# EAGLE design msp430_funky (EAGLE 7.5.0)
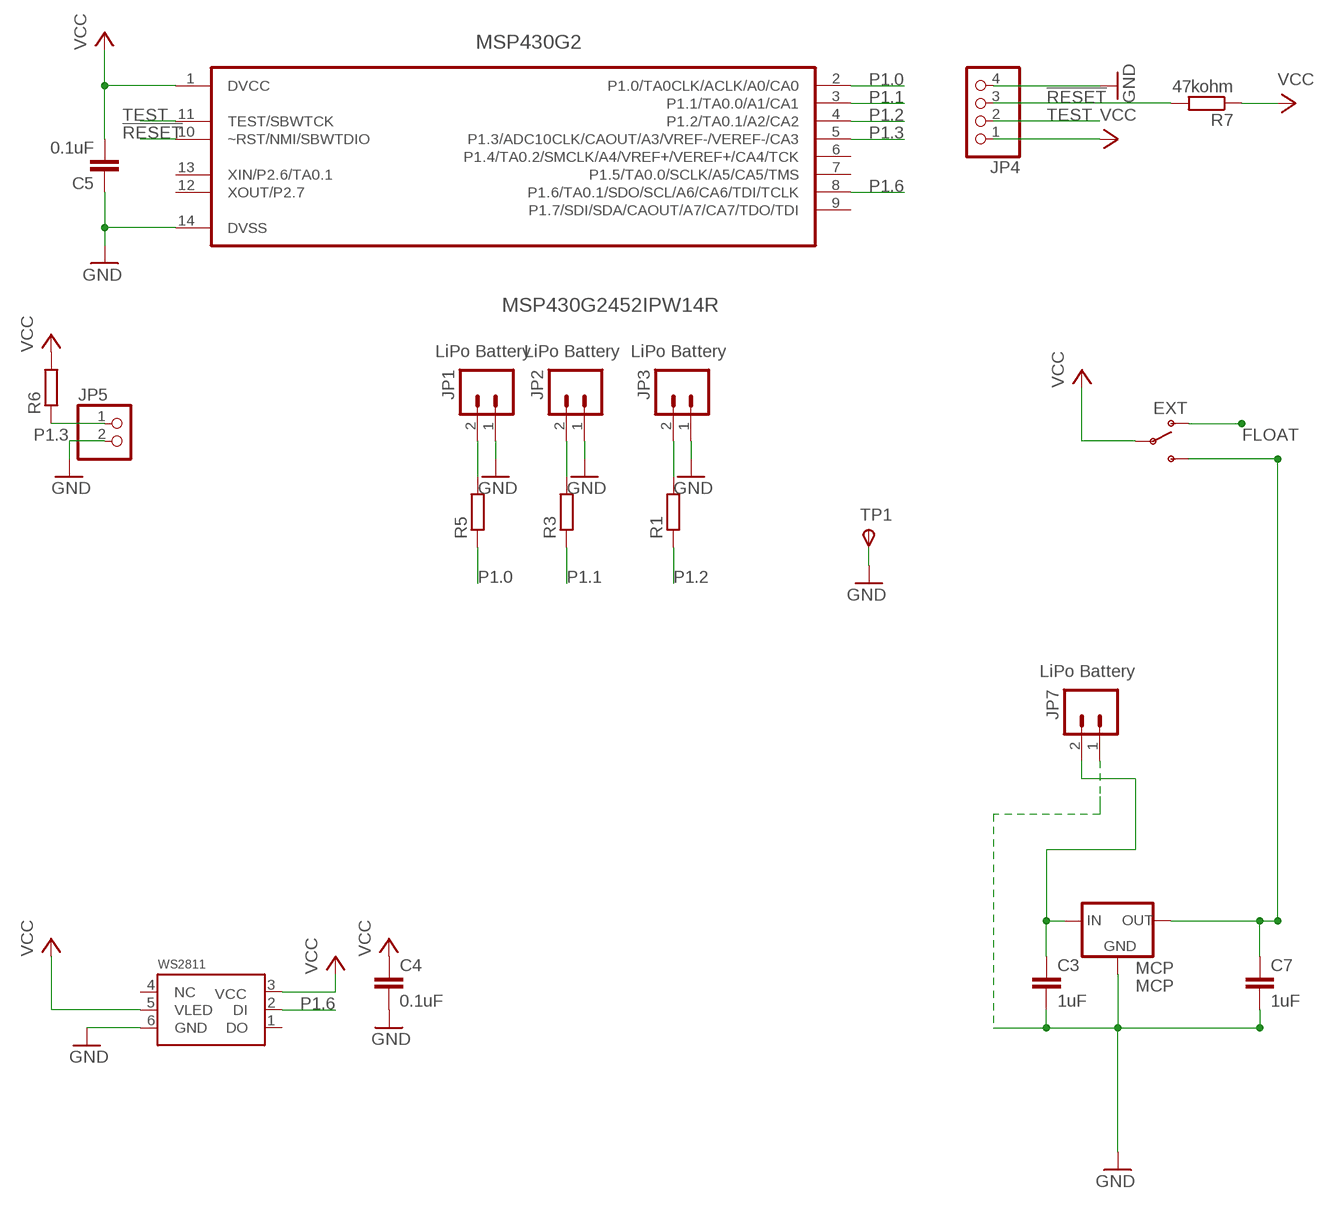
[diagram p0: schematic, sheet 1]

## Parts
C3  1uF  C-EUC0805  [C0805]
C4  0.1uF  C-EUC0805  [C0805]
C5  0.1uF  C-EUC0805  [C0805]
C7  1uF  C-EUC0805  [C0805]
JP1  LiPo Battery  M02JST-PTH-2  [JST-2-PTH]
JP2  LiPo Battery  M02JST-PTH-2  [JST-2-PTH]
JP3  LiPo Battery  M02JST-PTH-2  [JST-2-PTH]
JP4  PINHD-1X4  [1X04]
JP5  PINHD-1X2  [1X02]
JP7  LiPo Battery  M02JST-PTH-2  [JST-2-PTH]
MCP  MCP  MCP1700SOT-23  [SOT-23]
MSP430G2  MSP430G2452IPW14R  [SOP65P640X120-14N]
ON  EXT  SWITCH-SPSTPTH  [SWITCH-SPDT]
R1  R-EU_R0805  [R0805]
R3  R-EU_R0805  [R0805]
R5  R-EU_R0805  [R0805]
R6  R-EU_R0805  [R0805]
R7  47kohm  R-EU_R0805  [R0805]
TP1  TPSTP20R  [TP20R]
WS2811  5050WS2811W  [RGBLED5050W]

## Nets
!RESET: JP4.3 MSP430G2.10(~RST/NMI/SBWTDIO) R7.2
FLOAT: ON.1(O)
GND [GND]: C3.2 C4.2 C5.1 C7.2 JP1.1 JP2.1 JP3.1 JP4.4 JP5.2 JP7.1 MCP.1(GND) MSP430G2.14(DVSS) TP1.TP(PP) WS2811.6(GND)
N$1: JP1.2 R5.2
N$2: JP2.2 R3.2
N$3: JP3.2 R1.2
P1.0: MSP430G2.2(P1.0/TA0CLK/ACLK/A0/CA0) R5.1
P1.1: MSP430G2.3(P1.1/TA0.0/A1/CA1) R3.1
P1.2: MSP430G2.4(P1.2/TA0.1/A2/CA2) R1.1
P1.3: JP5.1 MSP430G2.5(P1.3/ADC10CLK/CAOUT/A3/VREF-/VEREF-/CA3) R6.1
P1.6: MSP430G2.8(P1.6/TA0.1/SDO/SCL/A6/CA6/TDI/TCLK) WS2811.2(DI)
TEST: JP4.2 MSP430G2.11(TEST/SBWTCK)
VCC [VCC]: C4.1 C5.2 JP4.1 MSP430G2.1(DVCC) ON.2(P) R6.2 R7.1 WS2811.3(VCC) WS2811.5(VLED)
VCCEXT [VCC]: C3.1 JP7.2 MCP.3(IN)
VCCREG [VCC]: C7.1 MCP.2(OUT) ON.3(S)
Unconnected: MSP430G2.6(P1.4/TA0.2/SMCLK/A4/VREF+/VEREF+/CA4/TCK) MSP430G2.7(P1.5/TA0.0/SCLK/A5/CA5/TMS) MSP430G2.9(P1.7/SDI/SDA/CAOUT/A7/CA7/TDO/TDI) MSP430G2.12(XOUT/P2.7) MSP430G2.13(XIN/P2.6/TA0.1) WS2811.1(DO) WS2811.4(NC)

## Library data of the parts
C3-C5 C7 = resistor:C-EU: CAPACITOR, European symbol
JP1-JP3 JP7 = SparkFun:M02: Header 2 Standard 2-pin 0.1" header. Use with straight break away headers (SKU : PRT-00116), right angle break away headers (PRT-00553), swiss pins (PRT-00743), machine pins (PRT-00117), and female headers (PRT-00115). Molex polarized connector foot print use with SKU : PRT-08233 with associated crimp pins and housings.
JP4 = 43oh-SugarAddict:PINHD-1X4: PIN HEADER
JP5 = pinhead:PINHD-1X2: PIN HEADER
MCP = MY_IC:MCP1700
MSP430G2 = thierry_eagle:MSP430G2452IPW14R: MIXED SIGNAL MICROCONTROLLER; MPN: MSP430G2452IPW14R; OC_FARNELL: 1865385; OC_NEWARK: 21T2342; PACKAGE: TSSOP-14; SUPPLIER: Texas Instruments
ON = SparkFun:SWITCH-SPST: SPST Switch Simple slide switch. Spark Fun Electronics SKU : COM-00102
R1 R3 R5-R7 = resistor:R-EU_: RESISTOR, European symbol
TP1 = testpad:TPS: TEST PIN
WS2811 = 5050WS2811:5050WS2811

## Net classes
0 default: width 0.016 mm
1 GND: width 0.025 mm, drill 0.508 mm, clearance 0.254 mm
2 VCC: width 0.025 mm, drill 0.508 mm, clearance 0.254 mm

## Board
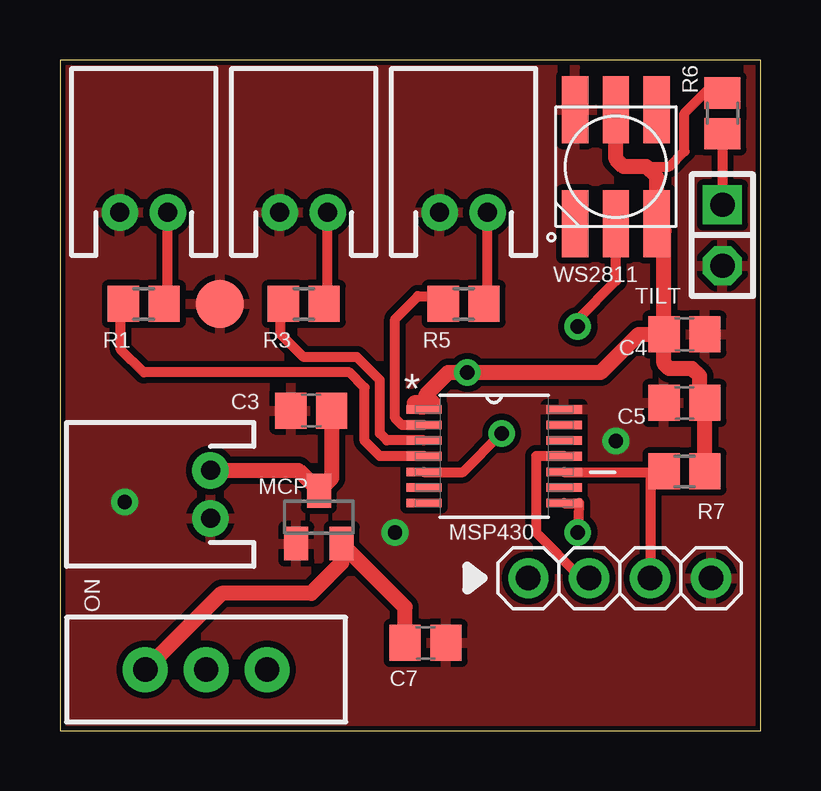
[diagram p1: board, top side]
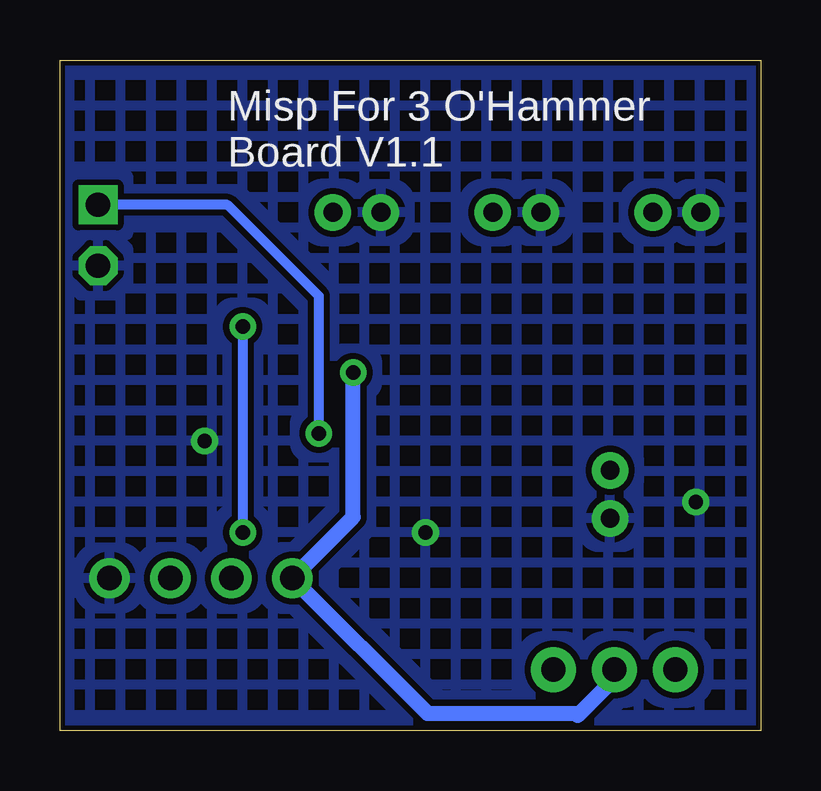
[diagram p2: board, bottom side, seen from below]

Size 29.21 x 27.94 mm. Coordinates in mm from the lower left corner, seen from the top.
Outline: 0,0 29.21,0 29.21,27.94 0,27.94 0,0
Copper layers (1*16): Top 0.035mm / dielectric 1.5mm / Bottom 0.035mm
Design rules "SparkFun *": minimum track width 20mil, minimum drill 20mil, track to track 8mil, track to pad 8mil, pad to pad 8mil, via to via 8mil, smd to smd 8mil, copper to edge 8mil, drill to drill 8mil, minimum pad ring 12mil, minimum via ring 10mil, stop-mask expansion 4mil, vias tented up to drill 25mil, thermal gap 10mil

### Footprints (pad centres in the part's own frame; a part is rotated, then mirrored left to right if it is on the bottom)
C0805 = smd 1.3 x 1.5: 1 -0.85,0; 2 0.85,0
JST-2-PTH = drill 0.787 pad 1.524: 1 -1,0; 2 1,0
1X04 = drill 1.016 pad 1.676: 1 -3.81,0; 2 -1.27,0; 3 1.27,0; 4 3.81,0
1X02 = drill 1.016 square: 1 -1.27,0 | drill 1.016 octagon: 2 1.27,0
SOT-23 = smd 1 x 1.4: 1 -0.95,-1.1; 2 0.95,-1.1; 3 0,1.1
SOP65P640X120-14N = smd 1.473 x 0.356: 1 -2.921,1.956; 2 -2.921,1.295; 3 -2.921,0.66; 4 -2.921,0; 5 -2.921,-0.66; 6 -2.921,-1.295; 7 -2.921,-1.956; 8 2.921,-1.956; 9 2.921,-1.295; 10 2.921,-0.66; 11 2.921,0; 12 2.921,0.66; 13 2.921,1.295; 14 2.921,1.956
SWITCH-SPDT = drill 1.016 pad 1.88: 1 0,2.54; 2 0,0; 3 0,-2.54
R0805 = smd 1.3 x 1.5: 1 -0.85,0; 2 0.85,0
TP20R = smd 2 x 2: TP 0,0
RGBLED5050W = smd 2.794 x 1.1: 1 -2.381,1.7; 2 -2.381,0; 3 -2.381,-1.7; 4 2.381,-1.7; 5 2.381,0; 6 2.381,1.7

### Placement (x,y rotation side)
C3  10.48,13.34 180 top
C4  26.04,16.51 0 top
C5  26.04,13.65 0 top
C7  15.24,3.65 0 top
JP1  16.83,21.59 0 top
JP2  10.16,21.59 0 top
JP3  3.49,21.59 0 top
JP4  23.34,6.35 0 top
JP5  27.62,20.64 270 top
JP7  6.27,9.84 90 top
MCP  10.79,8.89 0 top
MSP430G2  18.1,11.43 0 top
ON  6.1,2.54 270 top
R1  3.49,17.78 0 top
R3  10.16,17.78 0 top
R5  16.83,17.78 0 top
R6  27.62,25.72 90 top
R7  26.04,10.79 180 top
TP1  6.67,17.78 0 top
WS2811  23.18,23.5 90 top

### Tracks (layer width: path | path; a pad name or v marks a point on that pad's centre or on a via)
!RESET
  Top 0.406: MSP430G2.10 24.61,10.77 | R7.2 25.16,10.77 24.61,10.77 | 24.61,10.77 JP4.3
GND  (via drill 0.6)
  other vias: 23.18,12.07 2.7,9.53 13.97,8.25
  pour Top: -0.64,28.58 29.53,28.58 29.21,-0.64 -0.64,-0.64
  pour Bottom (hatched): -0.64,28.58 29.53,28.58 29.21,-0.64 -0.64,-0.64
N$1
  Top 0.406: R5.2 17.83,17.78 JP1.2
N$2
  Top 0.406: R3.2 11.16,17.78 JP2.2
N$3
  Top 0.406: R1.2 4.49,17.78 JP3.2
P1.0
  Top 0.406: MSP430G2.2 14.26,12.73 13.97,13.02 13.97,17.14 14.92,18.1 15.66,18.1 R5.1
P1.1
  Top 0.406: MSP430G2.3 13.63,12.09 13.33,12.38 13.33,14.61 12.38,15.56 10.16,15.56 9.21,16.51 9.21,17.68 R3.1
P1.2
  Top 0.406: MSP430G2.4 13.33,11.43 12.7,12.07 12.7,14.29 12.06,14.92 3.49,14.92 2.54,15.88 2.54,17.68 R1.1
P1.3  (via drill 0.6)
  Top 0.406: R6.1 JP5.1 | MSP430G2.5 16.8,10.77 v18.42,12.38
  Bottom 0.406: v18.42,12.38 18.42,18.1 22.23,21.91 JP5.1
P1.6  (via drill 0.6)
  Top 0.406: MSP430G2.8 21.64,9.47 v21.59,8.25 | 22.86,20.8 WS2811.2 23.18,18.73 21.59,17.14 v21.59,16.83
  Bottom 0.406: v21.59,16.83 v21.59,8.25
TEST
  Top 0.406: MSP430G2.11 19.84,11.43 19.84,8.25 21.75,6.35 JP4.2
VCC  (via drill 0.6)
  Top 0.406: 24.45,23.5 25.4,23.5 26.04,24.13 26.04,25.72 26.99,26.67 27.52,26.67 R6.2 | 14.76,13.65 15.03,13.39 MSP430G2.1
  Top 0.635: 26.99,10.69 R7.1 C5.2 26.67,13.87 26.67,14.76 26.35,15.08 25.4,15.08 25.19,15.3 C4.1 | C4.1 24.13,16.51 22.54,14.92 v16.99,14.92 16.51,14.92 16.19,14.92 15.24,13.97 15.56,13.65 14.76,13.65 | C4.1 25.19,20.81 WS2811.3 24.88,23.07 24.45,23.5 23.5,23.5 23.18,23.81 WS2811.5
  Bottom 0.635: 7.62,0.63 7.54,0.71 | 7.54,0.71 6.1,2.16 ON.2 | 7.54,0.71 13.89,0.71 JP4.1 16.99,8.89 v16.99,14.92
VCCEXT
  Top 0.635: JP7.2 9.94,10.84 MCP.3 11.33,10.52 C3.1
VCCREG
  Top 0.635: ON.3 6.73,5.71 10.48,5.71 11.74,6.98 MCP.2 14.39,5.14 C7.1

### Text on the board
tNames: TILT | MSP430
bNames: Misp For 3 O'Hammer / Board V1.1